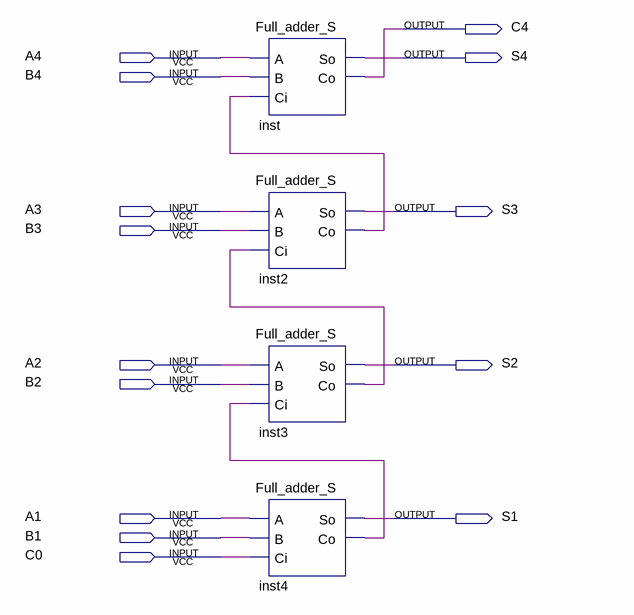
[diagram p0: schematic sheet]
// Quartus schematic four_bir_adder.bdf as structural Verilog: 4 symbols, 14 pins
module four_bir_adder (
  input  A4,
  input  B4,
  input  A3,
  input  B3,
  input  A2,
  input  B2,
  input  A1,
  input  B1,
  input  C0,
  output C4,
  output S4,
  output S3,
  output S2,
  output S1
);

  wire inst2_co, inst3_co, inst4_co;

  Full_adder_S inst (.A(A4), .B(B4), .Ci(inst2_co), .So(S4), .Co(C4));
  Full_adder_S inst2 (.A(A3), .B(B3), .Ci(inst3_co), .So(S3), .Co(inst2_co));
  Full_adder_S inst3 (.A(A2), .B(B2), .Ci(inst4_co), .So(S2), .Co(inst3_co));
  Full_adder_S inst4 (.A(A1), .B(B1), .Ci(C0), .So(S1), .Co(inst4_co));
endmodule
